# EAGLE design CurrentMonitor (EAGLE 7.5.0)
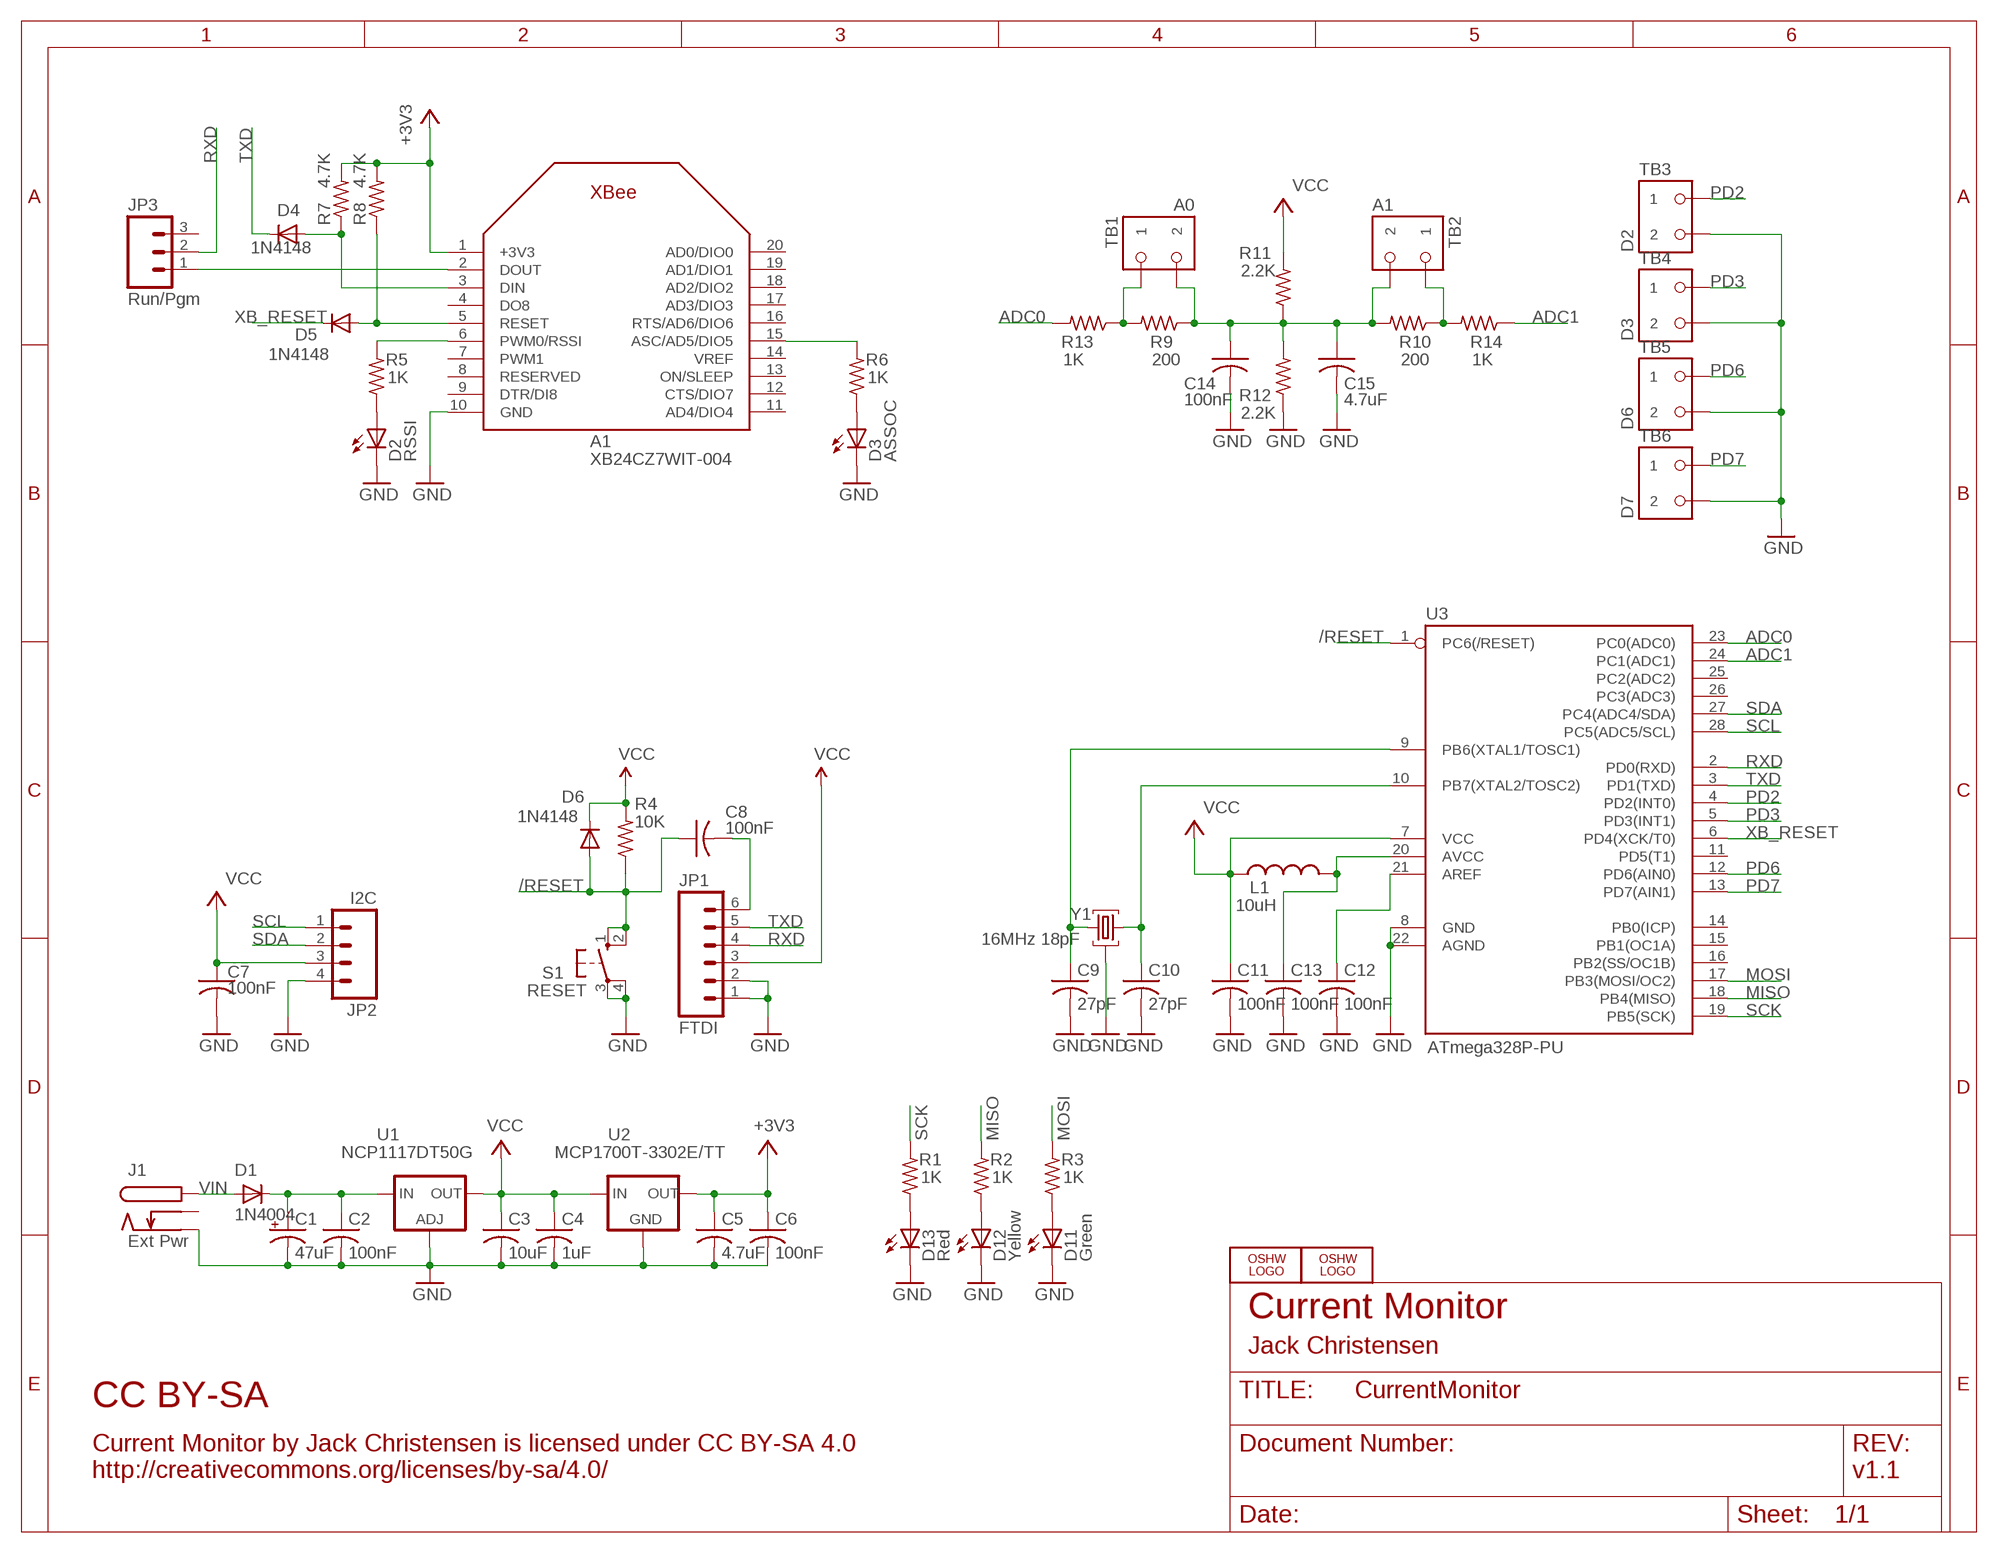
[diagram p0: schematic, sheet 1]

## Parts
A1  XB24CZ7WIT-004  ULINK_XBEEOVALPADS  [XBEE_OVAL_PADS]
C1  47uF  CPOL-USE5-5  [E5-5]
C2  100nF  C-USM0805  [M0805]
C3  10uF  C-USM0805  [M0805]
C4  1uF  C-USM0805  [M0805]
C5  4.7uF  C-USM0805  [M0805]
C6  100nF  C-USM0805  [M0805]
C7  100nF  C-USM0805  [M0805]
C8  100nF  C-USM0805  [M0805]
C9  27pF  C-USM0805  [M0805]
C10  27pF  C-USM0805  [M0805]
C11  100nF  C-USM0805  [M0805]
C12  100nF  C-USM0805  [M0805]
C13  100nF  C-USM0805  [M0805]
C14  100nF  C-USM0805  [M0805]
C15  4.7uF  C-USM0805  [M0805]
D1  1N4004  DIODE1N400X  [1N400X]
D2  RSSI  LEDD0805A  [D0805A]
D3  ASSOC  LEDD0805  [D0805]
D4  1N4148  DIODESOD-323F-A  [SOD-323F-A]
D5  1N4148  DIODESOD-323F-A  [SOD-323F-A]
D6  1N4148  DIODESOD-323F  [SOD-323F]
D11  Green  LEDD0805  [D0805]
D12  Yellow  LEDD0805  [D0805]
D13  Red  LEDD0805  [D0805]
J1  Ext Pwr  POWER-JACK  [KLDX-0202]
JP1  FTDI  M06LOCK  [1X06_LOCK]
JP2  I2C  M04LOCK  [1X04_LOCK]
JP3  Run/Pgm  M03LOCK  [1X03_LOCK]
L1  10uH  INDUCTORM0805  [M0805]
LOGO1  OSHW_LOGO_8MILX0100-NT  [OSHW_8X100_NOTEXT]
LOGO2  OSHW_LOGO_8MILX0100-NT  [OSHW_8X100_NOTEXT]
R1  1K  R-US_M0805  [M0805]
R2  1K  R-US_M0805  [M0805]
R3  1K  R-US_M0805  [M0805]
R4  10K  R-US_M0805  [M0805]
R5  1K  R-US_M0805  [M0805]
R6  1K  R-US_M0805  [M0805]
R7  4.7K  R-US_M0805  [M0805]
R8  4.7K  R-US_M0805  [M0805]
R9  200  R-US_M0805  [M0805]
R10  200  R-US_M0805  [M0805]
R11  2.2K  R-US_M0805  [M0805]
R12  2.2K  R-US_M0805  [M0805]
R13  1K  R-US_M0805  [M0805]
R14  1K  R-US_M0805  [M0805]
S1  RESET  10-XXOCT  [B3F-10XXOCT]
TB1  A0  OST-TB-23.5MM  [OST-TB-2-3.5MM]
TB2  A1  OST-TB-23.5MM  [OST-TB-2-3.5MM]
TB3  D2  OST-TB-23.5MM  [OST-TB-2-3.5MM]
TB4  D3  OST-TB-23.5MM  [OST-TB-2-3.5MM]
TB5  D6  OST-TB-23.5MM  [OST-TB-2-3.5MM]
TB6  D7  OST-TB-23.5MM  [OST-TB-2-3.5MM]
U1  NCP1117DT50G  LD117ADT50TR  [DPACK]
U2  MCP1700T-3302E/TT  MCP1700SOT23-W  [SOT23-W]
U3  ATmega328P-PU  AVR-MEGA8-PPTH  [DIL28-3]
Y1  16MHz 18pF  RESONATOR  [RESONATOR]

## Nets
+3V3: A1.1(+3V3) C5.1 C6.1 R7.2 R8.2 U2.2(OUT)
/RESET: C8.1 D6.A R4.1 S1.1(S) S1.2(S1) U3.1(PC6(/RESET))
ADC0: R13.2 U3.23(PC0(ADC0))
ADC1: R14.1 U3.24(PC1(ADC1))
GND: A1.10(GND) C1.- C2.2 C3.2 C4.2 C5.2 C6.2 C7.2 C9.2 C10.2 C11.2 C12.2 C13.2 C14.2 C15.2 D2.K(C) D3.K(C) D11.K(C) D12.K(C) D13.K(C) J1.P$2 JP1.1 JP1.2 JP2.4 R12.1 S1.3(P) S1.4(P1) TB3.P$2 TB4.P$2 TB5.P$2 TB6.P$2 U1.1(ADJ) U2.1(GND) U3.8(GND) U3.22(AGND) Y1.2
MISO: R2.2 U3.18(PB4(MISO))
MOSI: R3.2 U3.17(PB3(MOSI/OC2))
N$1: D13.A R1.1
N$2: D1.A J1.P$1
N$3: C14.1 C15.1 R9.1 R10.2 R11.1 R12.2 TB1.P$2 TB2.P$2
N$4: C10.1 U3.10(PB7(XTAL2/TOSC2)) Y1.3
N$5: C13.1 L1.2 U3.20(AVCC)
N$6: C9.1 U3.9(PB6(XTAL1/TOSC1)) Y1.1
N$7: C12.1 U3.21(AREF)
N$8: A1.3(DIN) D4.A R7.1
N$9: D12.A R2.1
N$10: A1.2(DOUT) JP3.1
N$11: D2.A R5.1
N$12: D3.A R6.1
N$13: A1.6(PWM0/RSSI) R5.2
N$14: A1.15(ASC/AD5/DIO5) R6.2
N$15: R9.2 R13.1 TB1.P$1
N$16: R10.1 R14.2 TB2.P$1
N$17: A1.5(RESET) D5.A R8.1
N$18: D11.A R3.1
PD2: TB3.P$1 U3.4(PD2(INT0))
PD3: TB4.P$1 U3.5(PD3(INT1))
PD6: TB5.P$1 U3.12(PD6(AIN0))
PD7: TB6.P$1 U3.13(PD7(AIN1))
RST: C8.2 JP1.6
RXD: JP1.4 JP3.2 U3.2(PD0(RXD))
SCK: R1.2 U3.19(PB5(SCK))
SCL: JP2.1 U3.28(PC5(ADC5/SCL))
SDA: JP2.2 U3.27(PC4(ADC4/SDA))
TXD: D4.K JP1.5 U3.3(PD1(TXD))
VCC: C3.1 C4.1 C7.1 C11.1 D6.K JP1.3 JP2.3 L1.1 R4.2 R11.2 U1.4(OUT) U2.3(IN) U3.7(VCC)
VIN: C1.+ C2.1 D1.K U1.3(IN)
XB_RESET: D5.K U3.6(PD4(XCK/T0))
Unconnected: A1.4(DO8) A1.7(PWM1) A1.8(RESERVED) A1.9(DTR/DI8) A1.11(AD4/DIO4) A1.12(CTS/DIO7) A1.13(ON/SLEEP) A1.14(VREF) A1.16(RTS/AD6/DIO6) A1.17(AD3/DIO3) A1.18(AD2/DIO2) A1.19(AD1/DIO1) A1.20(AD0/DIO0) J1.P$3 JP3.3 U3.11(PD5(T1)) U3.14(PB0(ICP)) U3.15(PB1(OC1A)) U3.16(PB2(SS/OC1B)) U3.25(PC2(ADC2)) U3.26(PC3(ADC3))

## Notes on the sheet
- Current Monitor
- Jack Christensen
- CC BY-SA
- Current Monitor by Jack Christensen is licensed under CC BY-SA 4.0
  http://creativecommons.org/licenses/by-sa/4.0/
- v1.1

## Library data of the parts
A1 = _jc:ULINK_XBEE
C1 = _jc:CPOL-US: POLARIZED CAPACITOR, American symbol
C2-C15 = _jc:C-US: CAPACITOR, American symbol
D1 D4-D6 = _jc:DIODE
D2 D3 D11-D13 = _jc:LED: LED OSRAM: - CHIPLED LG R971, LG N971, LY N971, LG Q971, LY Q971, LO R971, LY R971 LH N974, LH R974 LS Q976, LO Q976, LY Q976 LO Q996 - Hyper CHIPLED LW Q18S LB Q993, LB Q99A, LB R99A - SideLED LS A670, LO A670, LY A670, LG A670, LP A670 LB A673, LV A673, LT A673, LW A673 LH A674 LY A675 LS A676, LA A676, LO A676, LY A676, LW A676 LS A679, LY A679, LG A679 - Hyper Micro SIDELED® LS Y876, LA Y876, LO Y876, LY Y876 LT Y87S - SmartLED LW L88C, LW L88S LB L89C, LB L89S, LG L890 LS L89K, LO L89K, LY L89K LS L896, LA L896, LO L896, LY L896 - TOPLED LS T670, LO T670, LY T670, LG T670, LP T670 LSG T670, LSP T670, LSY T670, LOP T670, LYG T670 LG T671, LOG T671, LSG T671 LB T673, LV T673, LT T673, LW T673 LH T674 LS T676, LA T676, LO T676, LY T676, LB T676, LH T676, LSB T676, LW T676 LB T67C, LV T67C, LT T67C, LS T67K, LO T67K, LY T67K, LW E67C LS E67B, LA E67B, LO E67B, LY E67B, LB E67C, LV E67C, LT E67C LW T67C LS T679, LY T679, LG T679 LS T770, LO T770, LY T770, LG T770, LP T770 LB T773, LV T773, LT T773, LW T773 LH T774 LS E675, LA E675, LY E675, LS T675 LS T776, LA T776, LO T776, LY T776, LB T776 LHGB T686 LT T68C, LB T68C - Hyper Mini TOPLED® LB M676 - Mini TOPLED Santana® LG M470 LS M47K, LO M47K, LY M47K Source: http://www.osram.convergy.de/
J1 = _jc:POWER-JACK
JP1 = SparkFun:M06: Header 6 Standard 6-pin 0.1" header. Use with straight break away headers (SKU : PRT-00116), right angle break away headers (PRT-00553), swiss pins (PRT-00743), machine pins (PRT-00117), and female headers (PRT-00115). Molex polarized connector foot print use with SKU : PRT-08094 with associated crimp pins and housings. NOTES ON THE VARIANTS LOCK and LOCK_LONGPADS... This footprint was designed to help hold the alignment of a through-hole component (i.e. 6-pin header) while soldering it into place. You may notice that each hole has been shifted either up or down by 0.005 of an inch from it's more standard position (which is a perfectly straight line). This slight alteration caused the pins (the squares in the middle) to touch the edges of the holes. Because they are alternating, it causes a "brace" to hold the component in place. 0.005 has proven to be the perfect amount of "off-center" position when using our standard breakaway headers. Although looks a little odd when you look at the bare footprint, once you have a header in there, the alteration is very hard to notice. Also, if you push a header all the way into place, it is covered up entirely on the bottom side. This idea of altering the position of holes to aid alignment will be further integrated into the Sparkfun Library for other footprints. It can help hold any component with 3 or more connection pins.
JP2 = SparkFun:M04: Header 4 Standard 4-pin 0.1" header. Use with straight break away headers (SKU : PRT-00116), right angle break away headers (PRT-00553), swiss pins (PRT-00743), machine pins (PRT-00117), and female headers (PRT-00115). Molex polarized connector foot print use with SKU : PRT-08231 with associated crimp pins and housings.
JP3 = SparkFun:M03: Header 3 Standard 3-pin 0.1" header. Use with straight break away headers (SKU : PRT-00116), right angle break away headers (PRT-00553), swiss pins (PRT-00743), machine pins (PRT-00117), and female headers (PRT-00115). Molex polarized connector foot print use with SKU : PRT-08232 with associated crimp pins and housings.
L1 = _jc:INDUCTOR: Murata #11R472C
LOGO1 LOGO2 = ohw-logo:OSHW_LOGO_8MIL
R1-R14 = _jc:R-US_: RESISTOR, American symbol
S1 = _jc:10-XX: OMRON SWITCH
TB1-TB6 = _jc:OST-TB-2
U1 = v-reg:LD117A?*: Low drop fixed and adjustable positive voltage regulators 1 A Source: http://www.st.com/stonline/products/literature/ds/7194/ld1117axx.pdf
U2 = _jc:MCP1700: VOLTAGE REGULATOR
U3 = SparkFun:AVR-MEGA8-P: MICROCONTROLLER 8 Kbytes FLASH 1 kbytes SRAM 512 bytes EEPROM USART 4-channel 10 bit ADC 2-channel 8 bit ADC
Y1 = _jc:RESONATOR: Ceramic resonator with capacitors or HC49/US crystal

## Board
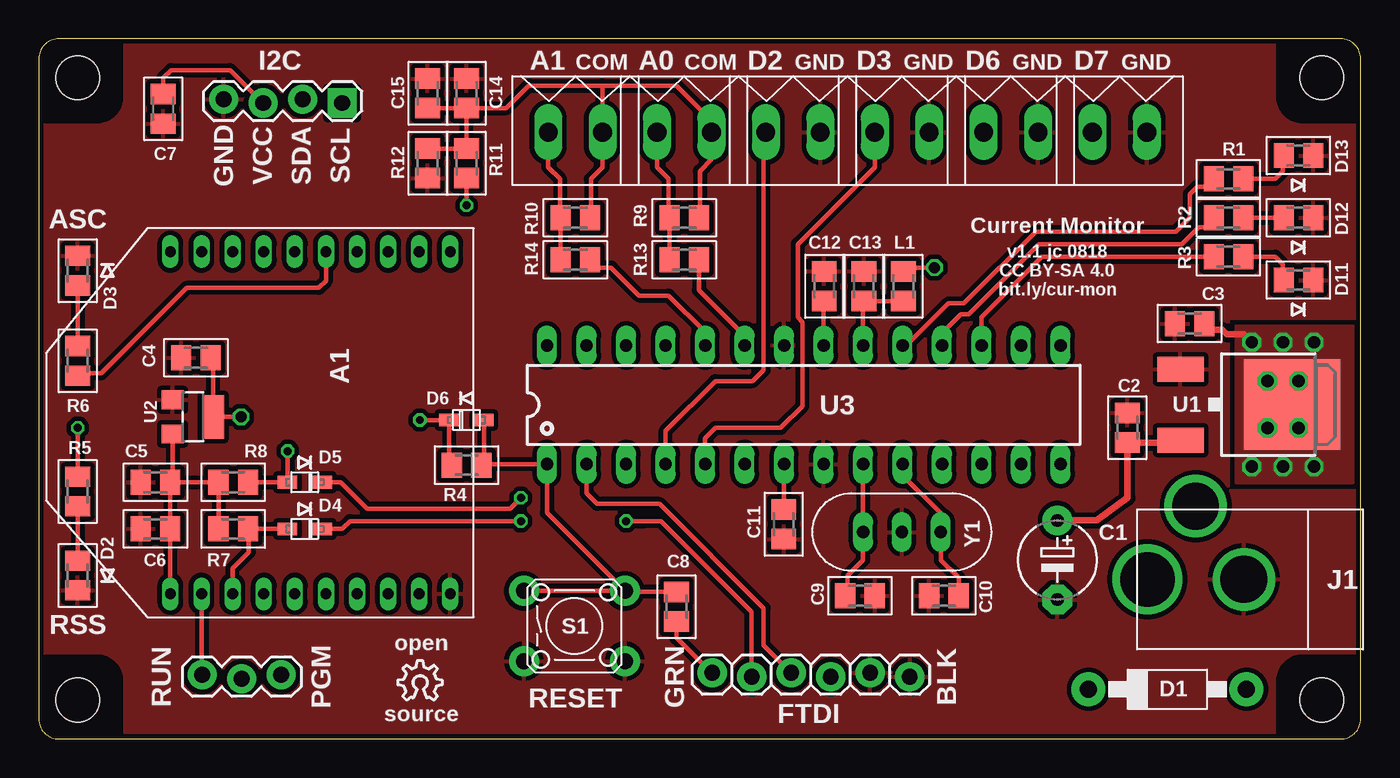
[diagram p1: board, top side]
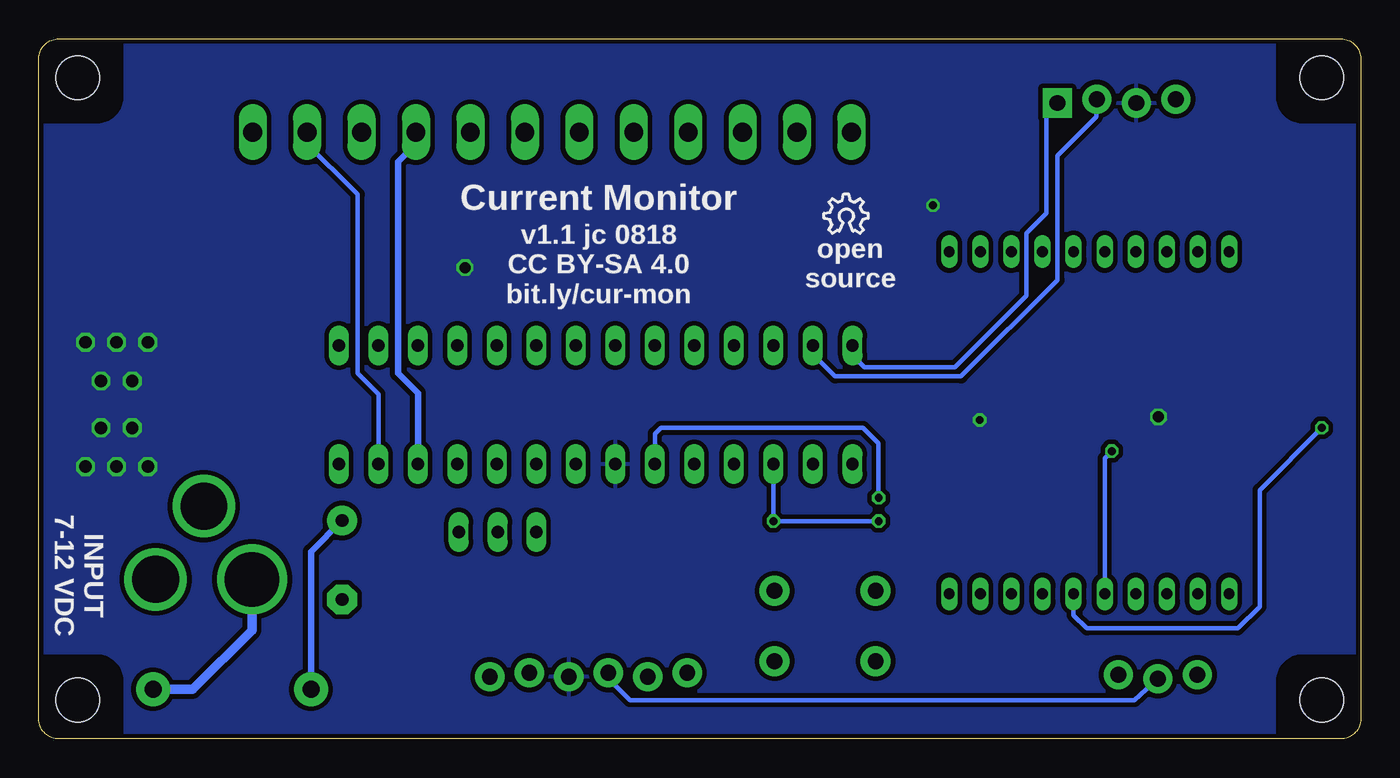
[diagram p2: board, bottom side, seen from below]

Size 85 x 45 mm. Coordinates in mm from the lower left corner, seen from the top.
Outline: 1.27,0 83.73,0 arc90 85,1.27 85,43.73 arc90 83.73,45 1.27,45 arc90 0,43.73 0,1.27 arc90 1.27,0
Copper layers (1*16): Top 0.0356mm / dielectric 1.5011mm / Bottom 0.0356mm
Design rules "oshpark-2layer-jc": minimum track width 8mil, minimum drill 13mil, track to track 8mil, track to pad 8mil, pad to pad 8mil, via to via 8mil, smd to smd 6mil, copper to edge 12mil, drill to drill 6mil, minimum pad ring 7mil, minimum via ring 7mil, stop-mask expansion 2.5mil, vias tented up to drill 20mil, thermal gap 12mil
Holes 2.8 mm at 2.5,2.5 2.5,42.5 82.5,42.5 82.5,2.5
tRestrict: area 80,40 to 85,45; area 80,0 to 85,5; area 0,40 to 5,45; area 0,0 to 5,5
bRestrict: area 0,0 to 5,5; area 0,40 to 5,45; area 80,0 to 85,5; area 80,40 to 85,45

### Footprints (pad centres in the part's own frame; a part is rotated, then mirrored left to right if it is on the bottom)
XBEE_OVAL_PADS = drill 0.7 pad 1 long: 1 -11,5.5; 2 -11,3.5; 3 -11,1.5; 4 -11,-0.5; 5 -11,-2.5; 6 -11,-4.5; 7 -11,-6.5; 8 -11,-8.5; 9 -11,-10.5; 10 -11,-12.5; 11 11,-12.5; 12 11,-10.5; 13 11,-8.5; 14 11,-6.5; 15 11,-4.5; 16 11,-2.5; 17 11,-0.5; 18 11,1.5; 19 11,3.5; 20 11,5.5
E5-5 = drill 0.813 pad 1.905: + -2.54,0 | drill 0.813 pad 1.905 octagon: - 2.54,0
M0805 = smd 1.3 x 1.6: 1 -0.95,0; 2 0.95,0
1N400X = drill 1.1 pad 2.184: A 5.08,0; K -5.08,0
D0805A = smd 1.3 x 1.6: A -0.95,0; K 0.95,0
D0805 = smd 1.3 x 1.6: A -0.95,0; K 0.95,0
SOD-323F-A = smd 1.27 x 0.813: A -1.118,0; K 1.118,0
SOD-323F = smd 1.27 x 0.813: A -1.118,0; K 1.118,0
KLDX-0202 = drill 3.5: P$1 6.55,0 | drill 3: P$2 0.35,0; P$3 3.45,-4.7
1X06_LOCK = drill 1.016 pad 1.88: 1 0,0; 2 2.54,-0.254; 3 5.08,0; 4 7.62,-0.254; 5 10.16,0; 6 12.7,-0.254
1X04_LOCK = drill 1.016 pad 1.88 square: 1 0,0.127 | drill 1.016 pad 1.88: 2 2.54,-0.127; 3 5.08,0.127; 4 7.62,-0.127
1X03_LOCK = drill 1.016 pad 1.88: 1 0,0.127; 2 2.54,-0.127; 3 5.08,0.127
B3F-10XXOCT = drill 1.016 pad 1.93: 1 -3.251,2.261; 2 3.251,2.261; 3 -3.251,-2.261; 4 3.251,-2.261
OST-TB-2-3.5MM = drill 1.2 long: P$1 1.75,0; P$2 -1.75,0
DPACK = smd 1.6 x 3: 1 -2.28,-4.8; 3 2.28,-4.8 | smd 5.8 x 6.2: 4 0,2.38
SOT23-W = smd 1.2 x 1.4: 1 -1.1,-1.3; 2 1.1,-1.3 | smd 2.8 x 1.4: 3 0,1.3
DIL28-3 = drill 0.8 pad 1.27 long: 1 -16.51,-3.81; 2 -13.97,-3.81; 3 -11.43,-3.81; 4 -8.89,-3.81; 5 -6.35,-3.81; 6 -3.81,-3.81; 7 -1.27,-3.81; 8 1.27,-3.81; 9 3.81,-3.81; 10 6.35,-3.81; 11 8.89,-3.81; 12 11.43,-3.81; 13 13.97,-3.81; 14 16.51,-3.81; 15 16.51,3.81; 16 13.97,3.81; 17 11.43,3.81; 18 8.89,3.81; 19 6.35,3.81; 20 3.81,3.81; 21 1.27,3.81; 22 -1.27,3.81; 23 -3.81,3.81; 24 -6.35,3.81; 25 -8.89,3.81; 26 -11.43,3.81; 27 -13.97,3.81; 28 -16.51,3.81
RESONATOR = drill 0.8 pad 1.27 long: 1 -2.5,0; 2 0,0; 3 2.5,0

### Placement (x,y rotation side)
A1  13.96,20.32 90 top
C1  65.5,11.5 270 top
C2  70,20 90 top
C3  74,26.7 180 top
C4  10.1,24.5 180 top
C5  7.5,16.5 180 top
C6  7.5,13.5 180 top
C7  8,40.5 270 top
C8  41,8.5 270 top
C9  52.8,9.2 0 top
C10  58.2,9.2 180 top
C11  47.9,13.8 270 top
C12  50.5,29.1 90 top
C13  53.05,29.1 90 top
C14  25,41.5 90 top
C15  27.5,41.5 90 top
D1  72.58,3.19 0 top
D2  2.5,10.5 270 top
D3  2.5,30.1 90 top
D4  17.1,13.5 0 top
D5  17.1,16.5 0 top
D6  27.5,20.5 180 top
D11  81,29.5 0 top
D12  81,33.5 0 top
D13  81,37.5 0 top
J1  77.84,10.26 180 top
JP1  56,4 180 top
JP2  19.5,41 180 top
JP3  10.5,4 0 top
L1  55.6,29.1 270 top
LOGO1  23.1,2.5 0 top
LOGO2  34.5,32.5 0 bottom
R1  76.5,36 180 top
R2  76.5,33.5 180 top
R3  76.5,31 180 top
R4  27.5,17.6 180 top
R5  2.5,15.9 90 top
R6  2.5,24.3 270 top
R7  12.5,13.5 180 top
R8  12.5,16.5 180 top
R9  41.5,33.5 180 top
R10  34.5,33.5 0 top
R11  27.5,37 270 top
R12  25,37 90 top
R13  41.5,30.8 0 top
R14  34.5,30.8 180 top
S1  34.44,7.26 0 top
TB1  41.5,39 180 top
TB2  34.5,39 180 top
TB3  48.5,39 180 top
TB4  55.5,39 180 top
TB5  62.5,39 180 top
TB6  69.5,39 180 top
U1  78.22,21.49 270 top
U2  9.9,20.7 270 top
U3  49.19,21.48 0 top
Y1  55.5,13.3 0 top

### Tracks (layer width: path | path; a pad name or v marks a point on that pad's centre or on a via)
+3V3
  Top 0.305: U2.2 8.6,16.65 C5.1 | C5.1 C6.1 A1.1 | C5.1 R8.2 R7.2
/RESET
  Top 0.305: D6.A 28.62,17.77 R4.1 28.52,17.67 U3.1 32.68,14.53 S1.2 | C8.1 37.76,9.45 S1.2 | S1.2 S1.1
ADC0
  Top 0.305: R13.2 42.45,28.85 45.4,25.9 45.4,25.31 U3.23
ADC1
  Top 0.305: R14.1 35.95,30.3 36.8,30.3 38.6,28.5 40.5,28.5 42.84,26.16 U3.24
GND
  pour Top (isolate 0.305, rank 2): -0.5,-0.5 -0.5,45.5 85.5,45.5 85.5,-0.5
MISO
  Top 0.305: U3.18 58.08,26.08 59.3,27.3 59.8,27.3 64.3,31.8 73.5,31.8 74.6,32.9 74.95,32.9 R2.2
MOSI
  Top 0.305: U3.17 60.62,27.12 64.5,31 R3.2
N$1
  Top 0.305: R1.1 79.5,36 80,36.5 80,37.45 D13.A
N$2
  Bottom 0.61: D1.A 75.11,3.19 71.3,7 J1.P$1
N$3
  Top 0.305: R12.2 R11.1 C15.1 | C15.1 30.05,40.55 31.5,42 36.2,42 | C15.1 C14.1 | 36.2,42 41,42 43,40 43,39.25 TB1.P$2 43.25,37.25 42.5,36.5 42.5,34.05 R9.1 | 36.2,42 36.25,41.95 TB2.P$2 36.25,36.75 35.5,36 35.5,34.05 R10.2
N$4
  Top 0.305: U3.10 55.54,16.96 58,14.5 Y1.3 58,11.5 59.15,10.35 C10.1
N$5
  Top 0.305: U3.20 53,28.1 C13.1 L1.2
N$6
  Top 0.305: U3.9 Y1.1 53,11.5 52,10.5 52,9.35 C9.1
N$7
  Top 0.305: U3.21 50.46,28.11 C12.1
N$8
  Top 0.305: D4.A R7.1 13.5,13.45 13.5,12 12.46,10.96 A1.3
N$9
  Top 0.305: R2.1 D12.A
N$10
  Top 0.305: A1.2 10.46,4.04 JP3.1
N$11
  Top 0.305: R5.1 D2.A
N$12
  Top 0.305: D3.A R6.1
N$13  (via drill 0.5)
  Top 0.305: v2.5,20 R5.2
  Bottom 0.305: v2.5,20 6.5,16 6.5,8.5 7.9,7.1 17.6,7.1 18.46,7.96 A1.6
N$14
  Top 0.305: A1.15 18.46,29.46 18,29 9.5,29 4,23.5 2.65,23.5 R6.2
N$15
  Top 0.305: TB1.P$1 39.75,36.75 40.5,36 40.5,34.05 R9.2 R13.1
N$16
  Top 0.305: TB2.P$1 32.75,36.75 33.5,36 33.5,34.05 R10.1 R14.2
N$17  (via drill 0.5)
  Top 0.305: R8.1 D5.A 16,16.48 v16,18.5
  Bottom 0.305: A1.5 16.46,18.04 v16,18.5
N$18
  Top 0.305: R3.1 79.5,31 80,30.5 80,29.55 D11.A
PD2
  Top 0.305: U3.4 40.3,19.8 43.5,23 45.9,23 46.6,23.7 46.6,38.85 TB3.P$1
PD3
  Top 0.305: U3.5 42.84,19.34 43.5,20 47.7,20 49.1,21.4 49.1,26.8 48.8,27.1 48.8,31.8 53.75,36.75 TB4.P$1
PD6
  Bottom 0.406: U3.12 60.62,22.22 61.9,23.5 61.9,37.1 61,38 61,38.75 TB5.P$1
PD7
  Bottom 0.305: U3.13 63.16,22.16 64.5,23.5 64.5,35 68,38.5 68,38.75 TB6.P$1
RST
  Top 0.305: JP1.6 43.17,4.33 41,6.5 C8.2
RXD
  Top 0.305: U3.2 35.22,15.78 35.9,15.1 39.9,15.1 46.6,8.4 46.6,6.03 JP1.4
  Bottom 0.305: JP3.2 14.54,2.5 47,2.5 48.38,3.88 JP1.4
SCK
  Top 0.305: R1.2 75.05,35.5 74.5,35.5 74,35 74,33.5 73.1,32.6 64.1,32.6 59.5,28 58.5,28 55.79,25.29 U3.19
SCL
  Bottom 0.305: JP2.1 20.2,40.17 20.2,33.8 21.5,32.5 21.5,28.5 26.1,23.9 31.9,23.9 32.5,24.5 32.5,25.11 U3.28
SDA
  Bottom 0.305: JP2.2 17,41.09 17,40 19.5,37.5 19.5,29.5 25.7,23.3 33.8,23.3 35,24.5 35,25.07 U3.27
TXD  (via drill 0.5)
  Top 0.305: JP1.5 45.83,8.17 40,14 39.5,14 39,14 v37.76,14 | D4.K 19.5,13.5 20,14 v31,14
  Bottom 0.305: U3.3 v37.76,14 v31,14
VCC  (via drill 0.5, 0.7, 0.8)
  Top 0.305: v24.5,20.5 D6.K 26.38,17.77 R4.2 | v13,20.7 U2.3 11.2,24.35 C4.1 | U3.7 47.92,14.77 C11.1 | v57.6,30.3 55.85,30.3 L1.1 | C7.1 8,42.5 8.5,43 12.29,43 JP2.3 | v27.5,34.3 R11.2
  Top 0.406: v78,25.5 77.5,26 76.4,26 76.1,26.3 75.35,26.3 C3.1
  other vias: 80,25.5 82,25.5 78,17.5 80,17.5 82,17.5 79,23 81,23 79,20 81,20
  pour Bottom (isolate 0.305): -1,-1 86,-1 86,46 -1,46
  pour Top (isolate 0.305): 77,26.5 77,16.5 84.5,16.5 84.5,26.5
VIN
  Top 0.406: C1.+ 68.04,14.04 70,15.5 C2.1 73.26,19.05 U1.3
  Bottom 0.406: D1.K 67.5,12.04 C1.+
XB_RESET  (via drill 0.5)
  Top 0.305: D5.K 19.4,16.5 21.1,14.8 30.3,14.8 v31,15.5
  Bottom 0.305: U3.6 45.38,19.62 45,20 32,20 31,19 v31,15.5

### Text on the board
tPlace: Current Monitor | v1.1 jc 0818 / CC BY-SA 4.0 / bit.ly/cur-mon | open / / / source
bPlace: Current Monitor | open / source | v1.1 jc 0818 / CC BY-SA 4.0 / bit.ly/cur-mon | INPUT / 7-12 VDC
tNames: I2C | A1 | COM | A0 | COM | GND | GND | GND | GND | GND | VCC | SDA | SCL | ASC | RSS | RUN | PGM | GRN | BLK | RESET | FTDI